# Altium schematic sheet AD7190.SchDoc
size A4; DocumentNumber: 1; SheetNumber: 1; SheetTotal: 1
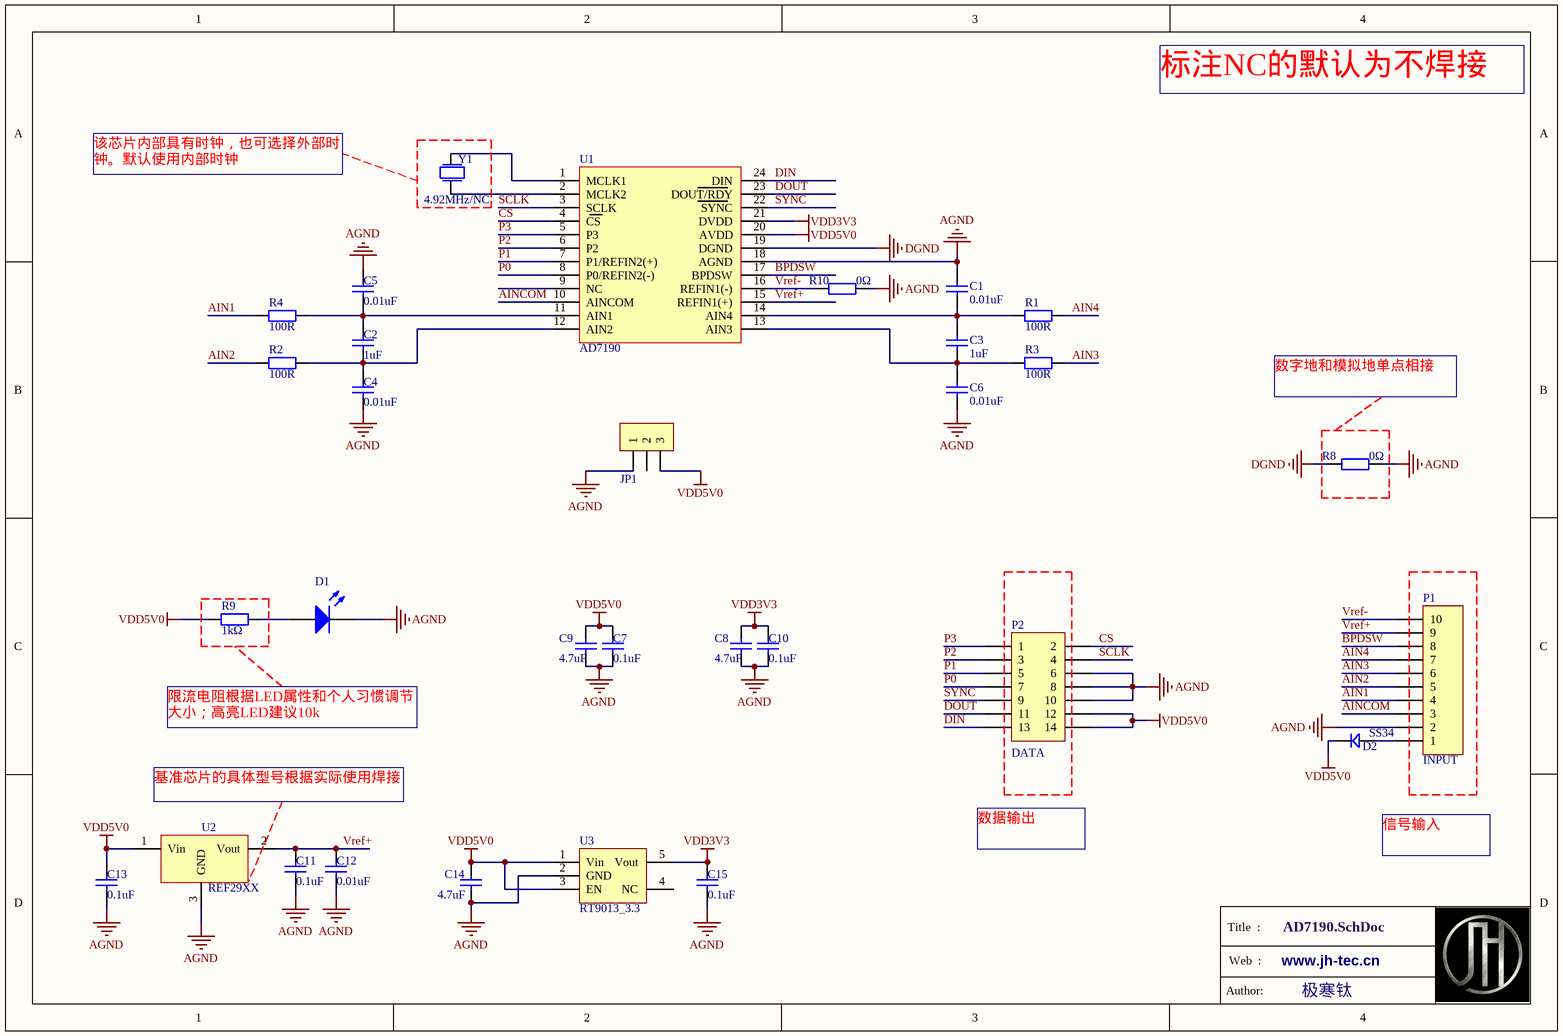
[diagram p0: AD7190.SchDoc]

## Parts
C1  0.01uF  [C0603]
C2  1uF  [C0603]
C3  1uF  [C0603]
C4  0.01uF  [C0603]
C5  0.01uF  [C0603]
C6  0.01uF  [C0603]
C7  0.1uF  [C0603]
C8  4.7uF  [C0805]
C9  4.7uF  [C0805]
C10  0.1uF  [C0603]
C11  0.1uF  [C0603]
C12  0.01uF  [C0603]
C13  0.1uF  [C0603]
C14  4.7uF  [C0805]
C15  0.1uF  [C0603]
D1  LED3  [LED_GREEN_0603]  (value not drawn)
D2  SS34  [DO-214AC]
JP1  HDR-1X3  [XH2.54-WI-3P]  (value not drawn)
P1  INPUT  [KF2EDGK-3.81-10P]
P2  DATA  [HDR2X7]
R1  100R  [R0603]
R2  100R  [R0603]
R3  100R  [R0603]
R4  100R  [R0603]
R8  0Ω  [R0603]
R9  1kΩ  [R0603]
R10  0Ω  [R0603]
U1  AD7190  [TSSOP24]
U2  REF29XX
U3  RT9013_3.3  [SOT23-5]
Y1  4.92MHz/NC  [XTAL-HC49S]

## Nets
AGND: C1.1 C4.2 C5.1 C6.2 C7.2 C8.1 C9.1 C10.2 C11.2 C12.2 C13.2 C14.1 C15.2 D1.2(K) JP1.1 P1.2 P2.6 P2.8 P2.10 R8.1 R10.1 U1.18(AGND) U2.3(GND) U3.2(GND)
DGND: R8.2 U1.19(DGND)
VDD3V3: C8.2 C10.1 C15.1 U1.21(DVDD) U3.5(Vout)
VDD5V0: C7.1 C9.2 C13.1 C14.2 D2.2 JP1.3 P2.12 P2.14 R9.2 U1.20(AVDD) U2.1(Vin) U3.1(Vin) U3.3(EN)
AIN1: P1.4 R4.1
AIN2: P1.5 R2.1
AIN3: P1.6 R3.1
AIN4: P1.7 R1.1
AINCOM: P1.3 U1.10(AINCOM)
BPDSW: P1.8 U1.17(BPDSW)
CS: P2.2 U1.4(CS)
DIN: P2.13 U1.24(DIN)
DOUT: P2.11 U1.23(DOUT/RDY)
P0: P2.7 U1.8(P0/REFIN2(-))
P1: P2.5 U1.7(P1/REFIN2(+))
P2: P2.3 U1.6(P2)
P3: P2.1 U1.5(P3)
SCLK: P2.4 U1.3(SCLK)
SYNC: P2.9 U1.22(SYNC)
Vref+: C11.1 C12.1 P1.9 U1.15(REFIN1(+)) U2.2(Vout)
Vref-: P1.10 R10.2 U1.16(REFIN1(-))
NetC1_2: C1.2 C3.1 R1.2 U1.14(AIN4)
NetC2_1: C2.1 C5.2 R4.2 U1.11(AIN1)
NetC2_2: C2.2 C4.1 R2.2 U1.12(AIN2)
NetC3_2: C3.2 C6.1 R3.2 U1.13(AIN3)
NetD1_1: D1.1(A) R9.1
NetD2_1: D2.1 P1.1
NetU1_1: U1.1(MCLK1) Y1.2
NetU1_2: U1.2(MCLK2) Y1.1

Not connected (* = marked no-connect by the designer): JP1 2; U1 9(NC); U3 4(NC)

## Notes on the sheet
- 标注NC的默认为不焊接
- 该芯片内部具有时钟，也可选择外部时钟。默认使用内部时钟
- 数字地和模拟地单点相接
- 限流电阻根据LED属性和个人习惯调节大小；高亮LED建议10k
- 基准芯片的具体型号根据实际使用焊接
- 数据输出
- 信号输入
- Title  :
- Web  :
- www.jh-tec.cn
- Author:
- 极寒钛

## Library data of the parts
C1-C15 = Cap Semi: Capacitor (Semiconductor SIM Model); Value: 103; Published: 8-Jun-2000; LatestRevisionDate: 29-May-2009; LatestRevisionNote: IPC-7351 Footprint Added.; PackageReference: C1206; Publisher: Altium Limited; PackageDescription: Chip Capacitor
D1 = LED3: Typical BLUE SiC LED; Published: 8-Jun-2000; LatestRevisionDate: 17-Dec-2003; LatestRevisionNote: PCB Footprint replaced.; DatasheetVersion: 16-Apr-2002; PackageVersion: 16-Apr-2002; PackageReference: 3.5X2.8X1.9; Publisher: Altium Limited; PackageDescription: SM LED; 2 C-Bend Leads; Body 3.5 x 2.8 x 1.9 mm, inc leads (LxWxH typ)
D2 = D: 1N4148
JP1 = Header 3: 3P接插件; BOM名称: 3P接插件
P1 = Header 10: Header, 10-Pin; LatestRevisionDate: 17-Jul-2002; LatestRevisionNote: Re-released for DXP Platform.; Publisher: Altium Limited
P2 = Header 7X2: Header, 7-Pin, Dual row; LatestRevisionDate: 17-Jul-2002; LatestRevisionNote: Re-released for DXP Platform.; Publisher: Altium Limited
R1-R4 R8-R10 = Res2: Resistor; Value: 1K; Published: 8-Jun-2000; LatestRevisionDate: 17-Jul-2002; LatestRevisionNote: Re-released for DXP Platform.; Publisher: Altium Limited
U3 = RT9013: LDO
Y1 = XTAL: MHz